# EAGLE design v1 (EAGLE 7.7.0)
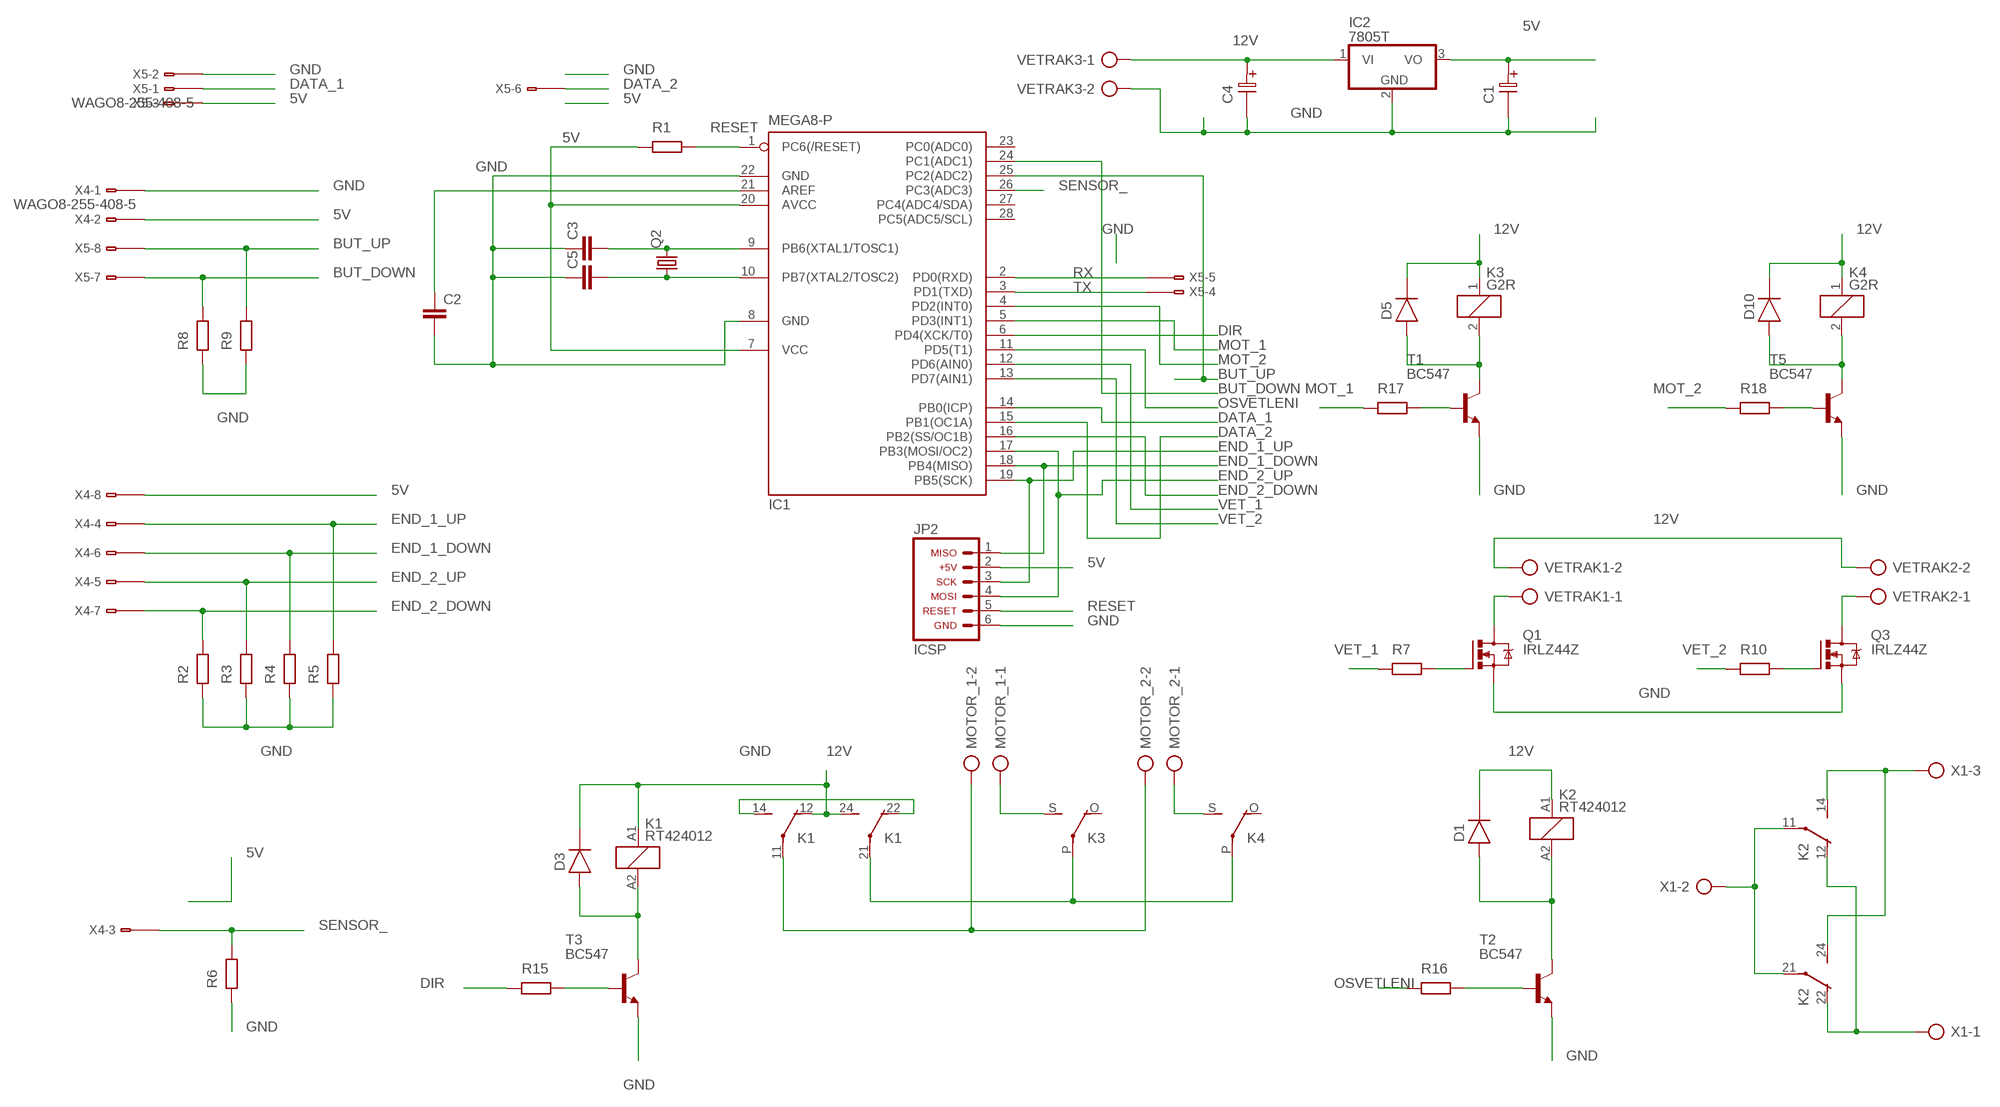
[diagram p0: schematic, sheet 1]

## Parts
C1  CT12  [CT12]
C2  C-EU025-030X050  [C025-030X050]
C3  C-EU050-025X075  [C050-025X075]
C4  CT12  [CT12]
C5  C-EU050-025X075  [C050-025X075]
D1  1N4007  [DO41]
D3  1N4007  [DO41]
D5  1N4007  [DO41]
D10  1N4007  [DO41]
IC1  MEGA8-P  [DIL28-3]
IC2  7805T  [TO220H]
JP2  ARDUINO_CONN-ICSP  [CONN-2X03]
K1  RT424012  [RT2C/O]
K2  RT424012  [RT2C/O]
K3  G2R  [G2R]
K4  G2R  [G2R]
MOTOR_1  AK500/2  [AK500/2]
MOTOR_2  AK500/2  [AK500/2]
Q1  IRLZ44Z  [TO220BH]
Q2  CRYSTALHC49S  [HC49/S]
Q3  IRLZ44Z  [TO220BH]
R1  RR  [RR]
R2  RR  [RR]
R3  RR  [RR]
R4  RR  [RR]
R5  RR  [RR]
R6  RR  [RR]
R7  RR  [RR]
R8  RR  [RR]
R9  RR  [RR]
R10  RR  [RR]
R15  RR  [RR]
R16  RR  [RR]
R17  RR  [RR]
R18  RR  [RR]
T1  BC547  [TO92]
T2  BC547  [TO92]
T3  BC547  [TO92]
T5  BC547  [TO92]
VETRAK1  AK500/2  [AK500/2]
VETRAK2  AK500/2  [AK500/2]
VETRAK3  AK500/2  [AK500/2]
X1  AK500/3-H  [AK500/3-H]
X4  WAGO8-255-408-5  [255-408-5]
X5  WAGO8-255-408-5  [255-408-5]

## Nets
5V: C1.1 IC1.7(VCC) IC1.20(AVCC) IC2.3(VO) JP2.2 R1.1 X4.B2(-2:B1) X4.B8(-8:B1) X5.B3(-3:B1)
12V: C4.1 D1.K D3.K D5.K D10.K IC2.1(VI) K1.12(2:O) K1.24(3:S) K1.A1 K2.A1 K3.1 K4.1 VETRAK1.2 VETRAK2.2 VETRAK3.1
BUT_DOWN: IC1.24(PC1(ADC1)) R8.2 X5.B7(-7:B1)
BUT_UP: IC1.25(PC2(ADC2)) R9.2 X5.B8(-8:B1)
DATA_1: IC1.14(PB0(ICP)) X5.B1(-1:B1)
DATA_2: IC1.15(PB1(OC1A)) X5.B6(-6:B1)
DIR: IC1.6(PD4(XCK/T0)) R15.1
END_1_DOWN: IC1.18(PB4(MISO)) JP2.1 R4.2 X4.B6(-6:B1)
END_1_UP: IC1.19(PB5(SCK)) JP2.3 R5.2 X4.B4(-4:B1)
END_2_DOWN: IC1.16(PB2(SS/OC1B)) R2.2 X4.B7(-7:B1)
END_2_UP: IC1.17(PB3(MOSI/OC2)) JP2.4 R3.2 X4.B5(-5:B1)
GND: C1.2 C2.2 C3.1 C4.2 C5.1 IC1.8(GND) IC1.22(GND) IC2.2(GND) JP2.6 K1.14(2:S) K1.22(3:O) Q1.S Q3.S R2.1 R3.1 R4.1 R5.1 R6.1 R8.1 R9.1 T1.1(E) T2.1(E) T3.1(E) T5.1(E) VETRAK3.2 X4.B1(-1:B1) X5.B2(-2:B1)
MOT_1: IC1.5(PD3(INT1)) R17.1
MOT_2: IC1.4(PD2(INT0)) R18.1
N$1: D3.A K1.A2 T3.3(C)
N$2: Q3.G R10.2
N$3: K1.11(2:P) MOTOR_1.2 MOTOR_2.2
N$4: K1.21(3:P) K3.P(2:P) K4.P(2:P)
N$5: K4.S(2:S) MOTOR_2.1
N$6: K3.S(2:S) MOTOR_1.1
N$7: R18.2 T5.2(B)
N$8: R15.2 T3.2(B)
N$9: C3.2 IC1.9(PB6(XTAL1/TOSC1)) Q2.2
N$10: C5.2 IC1.10(PB7(XTAL2/TOSC2)) Q2.1
N$11: D10.A K4.2 T5.3(C)
N$12: D5.A K3.2 T1.3(C)
N$13: R17.2 T1.2(B)
N$14: K2.12(2:O) K2.22(3:O) X1.1
N$15: D1.A K2.A2 T2.3(C)
N$16: K2.14(2:S) K2.24(3:S) X1.3
N$17: Q1.G R7.2
N$18: C2.1 IC1.21(AREF)
N$21: R16.2 T2.2(B)
N$23: Q3.D VETRAK2.1
N$24: Q1.D VETRAK1.1
N$26: K2.11(2:P) K2.21(3:P) X1.2
OSVETLENI: IC1.11(PD5(T1)) R16.1
RESET: IC1.1(PC6(/RESET)) JP2.5 R1.2
RX: IC1.2(PD0(RXD)) X5.B5(-5:B1)
SENSOR_: IC1.26(PC3(ADC3)) R6.2 X4.B3(-3:B1)
TX: IC1.3(PD1(TXD)) X5.B4(-4:B1)
VET_1: IC1.12(PD6(AIN0)) R7.1
VET_2: IC1.13(PD7(AIN1)) R10.1
Unconnected: IC1.23(PC0(ADC0)) IC1.27(PC4(ADC4/SDA)) IC1.28(PC5(ADC5/SCL)) K3.O(2:O) K4.O(2:O) X4.A1(-1:A1) X4.A2(-2:A1) X4.A3(-3:A1) X4.A4(-4:A1) X4.A5(-5:A1) X4.A6(-6:A1) X4.A7(-7:A1) X4.A8(-8:A1) X5.A1(-1:A1) X5.A2(-2:A1) X5.A3(-3:A1) X5.A4(-4:A1) X5.A5(-5:A1) X5.A6(-6:A1) X5.A7(-7:A1) X5.A8(-8:A1)

## Library data of the parts
C1 C4 = #_GM99:CT12
C2 C3 C5 = rcl:C-EU: CAPACITOR, European symbol
D1 D3 D5 D10 = #_GM99:1N4007
IC1 = atmel:MEGA8-P: MICROCONTROLLER 8 Kbytes FLASH, 1 kbytes SRAM, 512 bytes EEPROM, USART, 4-channel 10 bit ADC, 2-channel 8 bit ADC Pin compatible with Atmega48, ATMega88, ATMega168 Source: avr.lbr; OC_FARNELL: unknown; OC_NEWARK: unknown
IC2 = linear:78*: Positive VOLTAGE REGULATOR Source: http://cache.national.com/ds/LM/LM78L05.pdf http://www.fairchildsemi.com/ds/LM/LM7805.pdf
JP2 = arduino_jw:ARDUINO_CONN-ICSP: Arduino ICSP I/O Header This is the ICSP I/O header on the Arduino Uno R3. This connector is labeled with the following pin assignments: MISO +5V SCK MOSI RESET GND NOTE: Be sure you install this connector with the correct orientation on your PCB layout. Pin 1 has a square pad to assist with orientation.
K1 K2 = relay:RT42?*: Power PCB Relay SCHRACK 2 pole 8 A, DC and AC-coil Source: http://www.schrack.com/.. 5842.pdf; MPN: RT424012; OC_FARNELL: 1629053; OC_NEWARK: 03P2426
K3 K4 = relay:G2R: RELAY 1 x switch, Omron; OC_FARNELL: 1569185; OC_NEWARK: unknown
MOTOR_1 MOTOR_2 VETRAK1-VETRAK3 = #Svorkovnice:AK500/2: CONNECTOR
Q1 Q3 = transistor-power:IRLZ44Z: N-Channel HEXFET® Power MOSFET Logic Level AUTOMOTIVE MOSFET Source: http://www.irf.com/product-info/datasheets/data/irlz44zpbf.pdf
Q2 = crystal:CRYSTAL: CRYSTAL; OC_FARNELL: 1667008; OC_NEWARK: unknown
R1-R10 R15-R18 = #_GM99:RR
T1-T3 T5 = transistor-neu-to92:BC547: NPN TRANSISTOR
X1 = con-ptr500:AK500/3-H: CONNECTOR Aug. 2004 / PTR Meßtechnik: Die Bezeichnung der Serie AK505 wurde geändert. Es handelt sich hierbei um AK500 in horizontaler Ausführung.; OC_FARNELL: unknown; OC_NEWARK: unknown
X4 X5 = con-wago:WAGO8-: WAGO Cage Clamp; MPN: 255-408; OC_FARNELL: unknown; OC_NEWARK: 28K9773

## Board
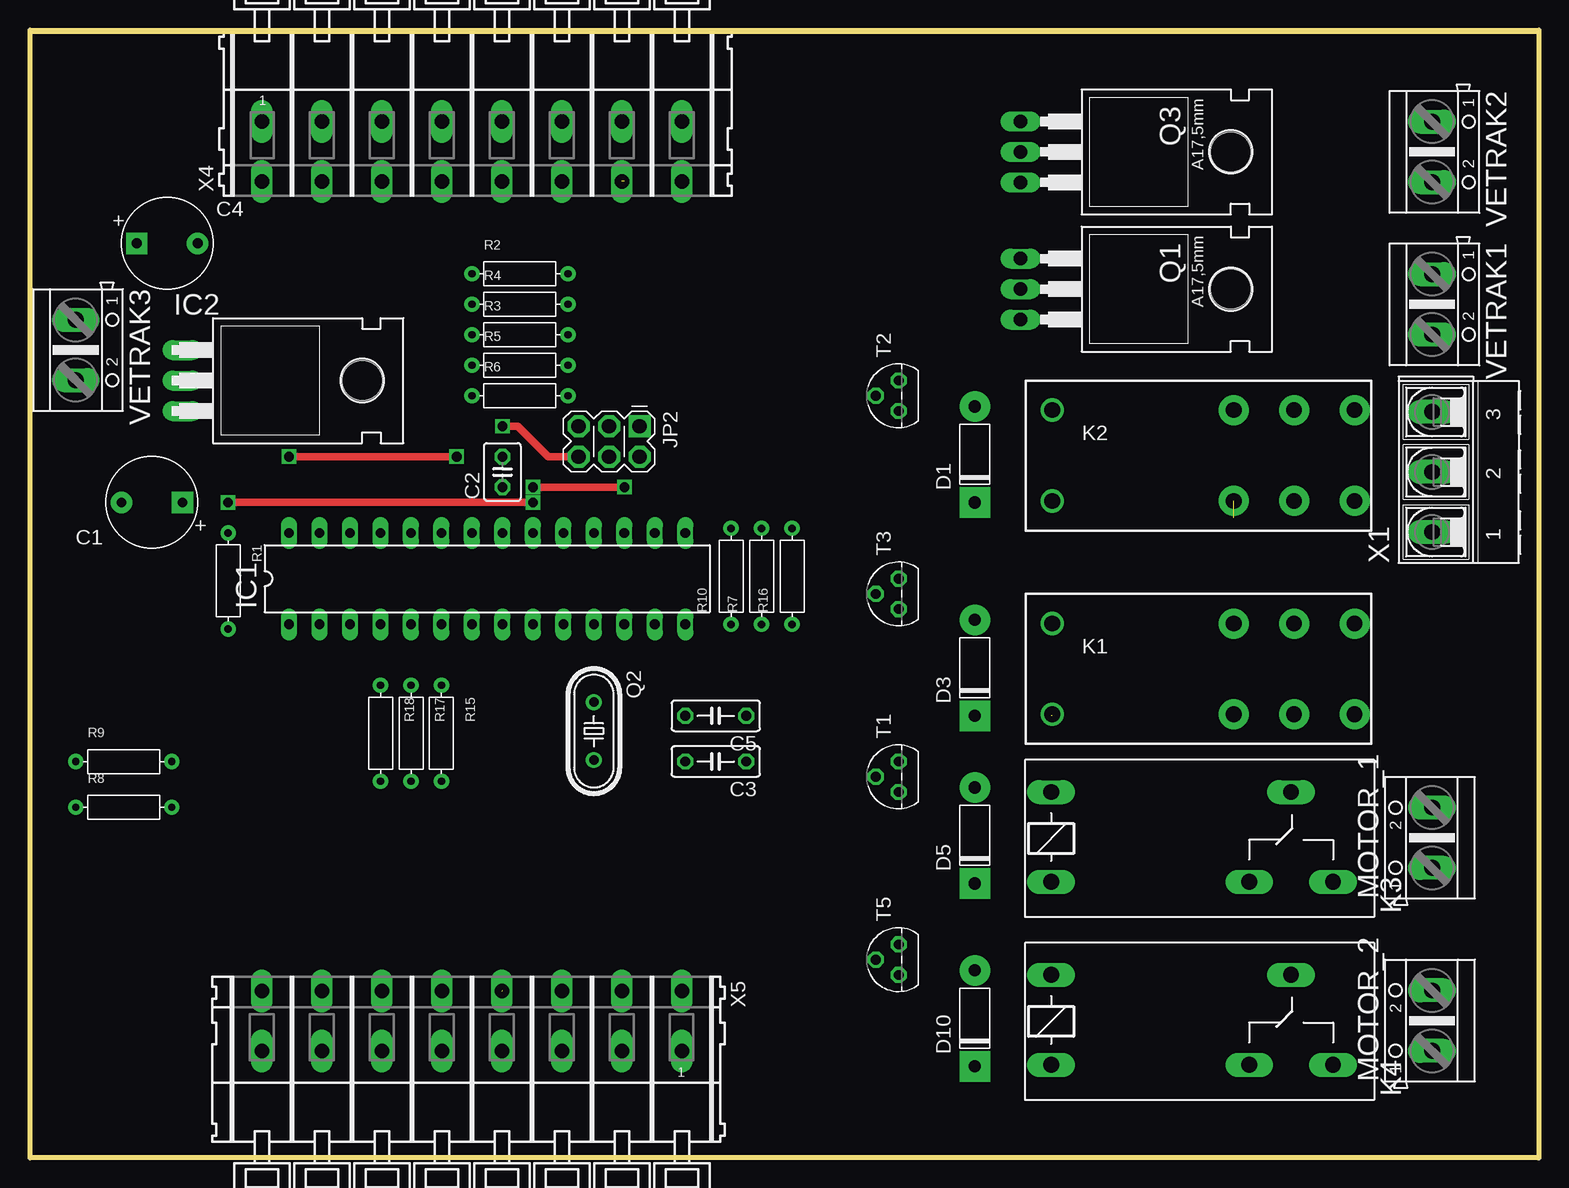
[diagram p1: board, top side]
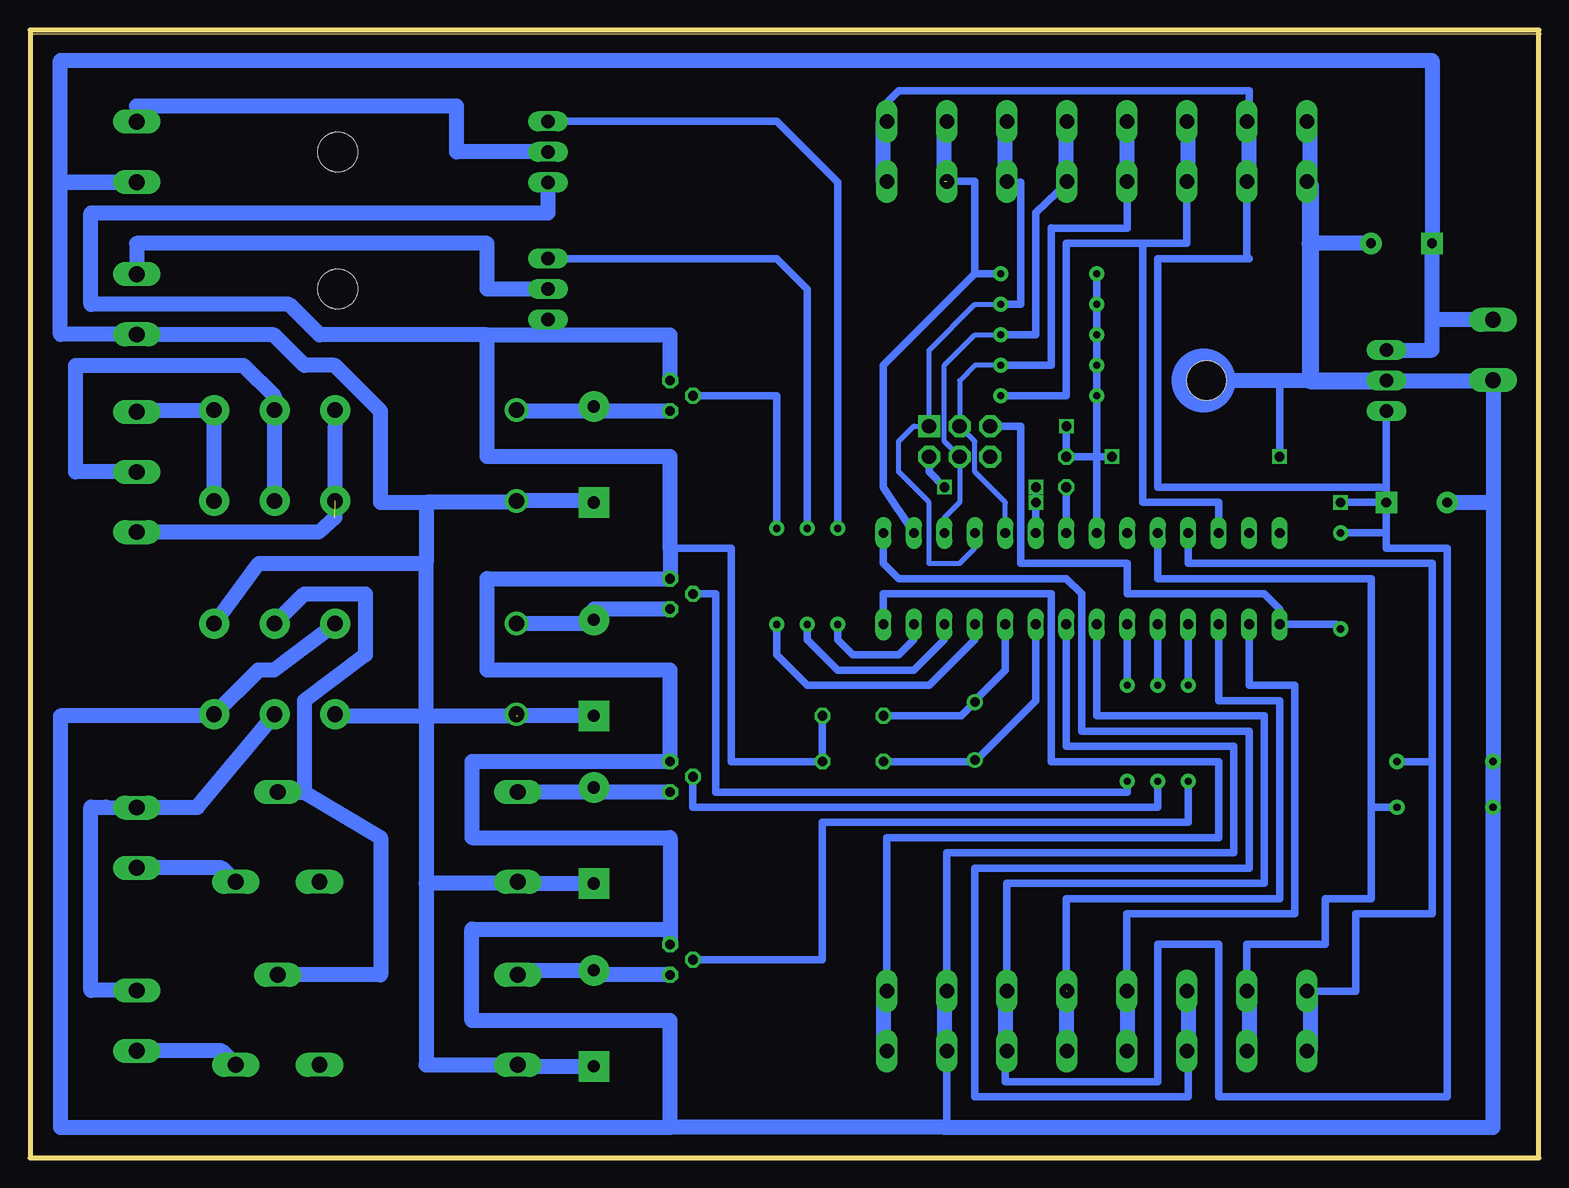
[diagram p2: board, bottom side, seen from below]

Size 125.73 x 93.98 mm. Coordinates in mm from the lower left corner, seen from the top.
Outline: 125.71,0 125.71,93.65 0,93.65
Outline: 0,93.65 0,0 125.71,0
Outline: 0,93.65 0,93.98 125.73,93.98 125.73,0 125.71,0
Copper layers (1*16): Top 0.035mm / dielectric 1.5mm / Bottom 0.035mm
Design rules "default": minimum track width 10mil, minimum drill 24mil, track to track 8mil, track to pad 8mil, pad to pad 8mil, via to via 8mil, smd to smd 8mil, copper to edge 40mil, drill to drill 8mil, minimum pad ring 10mil, minimum via ring 8mil, stop-mask expansion 4mil, vias tented up to drill 0mil, thermal gap 10mil

### Footprints (pad centres in the part's own frame; a part is rotated, then mirrored left to right if it is on the bottom)
CT12 = drill 0.813 pad 1.778 square: 1 0,0 | drill 0.813 pad 1.778: 2 5.08,0
C025-030X050 = drill 0.813 octagon: 1 -1.27,0; 2 1.27,0
C050-025X075 = drill 0.813 octagon: 1 -2.54,0; 2 2.54,0
DO41 = drill 1.016 pad 2.54: A 8,0 | drill 1.016 pad 2.54 square: K 0,0
DIL28-3 = drill 0.813 long: 1 -16.51,-3.81; 2 -13.97,-3.81; 3 -11.43,-3.81; 4 -8.89,-3.81; 5 -6.35,-3.81; 6 -3.81,-3.81; 7 -1.27,-3.81; 8 1.27,-3.81; 9 3.81,-3.81; 10 6.35,-3.81; 11 8.89,-3.81; 12 11.43,-3.81; 13 13.97,-3.81; 14 16.51,-3.81; 15 16.51,3.81; 16 13.97,3.81; 17 11.43,3.81; 18 8.89,3.81; 19 6.35,3.81; 20 3.81,3.81; 21 1.27,3.81; 22 -1.27,3.81; 23 -3.81,3.81; 24 -6.35,3.81; 25 -8.89,3.81; 26 -11.43,3.81; 27 -13.97,3.81; 28 -16.51,3.81
TO220H = drill 1.118 long: 1 -2.54,-10.16; 2 0,-10.16; 3 2.54,-10.16 | hole 3.302: 0,4.826
CONN-2X03 = drill 1.2 pad 1.829 square: 1 0,0 | drill 1.2 pad 1.829 octagon: 2 2.54,0; 3 0,-2.54; 4 2.54,-2.54; 5 0,-5.08; 6 2.54,-5.08
RT2C/O = drill 1.3 pad 2.5: 11 7.56,-3.68; 12 2.52,-3.68; 14 12.6,-3.68; 21 7.56,3.88; 22 2.52,3.88; 24 12.6,3.88 | drill 1.3: A1 -12.6,-3.68; A2 -12.6,3.88
G2R = drill 1.321 long: 1 -2.54,-3.683; 2 -2.54,3.81; O 13.97,-3.683; P 17.45,3.81; S 20.955,-3.683
AK500/2 = drill 1.321 long: 1 -2.515,0; 2 2.515,0
TO220BH = drill 1.118 long: D 0,-6.35; G -2.54,-6.35; S 2.54,-6.35 | hole 3.302: 0,11.176
HC49/S = drill 0.813: 1 -2.413,0; 2 2.413,0
RR = drill 0.61 pad 1.27: 1 0,0; 2 8,0
TO92 = drill 0.813 octagon: 1 1.27,0; 2 0,1.905; 3 -1.27,0
AK500/3-H = drill 1.321 long: 1 -5.004,0; 2 0,0; 3 5.004,0
255-408-5 = drill 1.2 long: A1 -17.5,0; A2 -12.5,0; A3 -7.5,0; A4 -2.5,0; A5 2.5,0; A6 7.5,0; A7 12.5,0; A8 17.5,0; B1 -17.5,-5; B2 -12.5,-5; B3 -7.5,-5; B4 -2.5,-5; B5 2.5,-5; B6 7.5,-5; B7 12.5,-5; B8 17.5,-5

### Placement (x,y rotation side)
C1  12.7,54.61 180 top
C2  39.37,57.15 90 top
C3  57.15,33.02 180 top
C4  8.89,76.2 0 top
C5  57.15,36.83 180 top
D1  78.74,54.61 90 top
D3  78.74,36.83 90 top
D5  78.74,22.86 90 top
D10  78.74,7.62 90 top
IC1  38.1,48.26 0 top
IC2  22.86,64.77 270 top
JP2  50.8,60.96 270 top
K1  97.79,40.64 0 top
K2  97.79,58.42 0 top
K3  87.63,26.67 0 top
K4  87.63,11.43 0 top
MOTOR_1  116.84,26.67 90 top
MOTOR_2  116.84,11.43 90 top
Q1  88.9,72.39 270 top
Q2  46.99,35.56 270 top
Q3  88.9,83.82 270 top
R1  16.51,52.07 270 top
R2  36.83,73.66 0 top
R3  36.83,68.58 0 top
R4  36.83,71.12 0 top
R5  36.83,66.04 0 top
R6  36.83,63.5 0 top
R7  60.96,44.45 90 top
R8  3.81,29.21 0 top
R9  3.81,33.02 0 top
R10  58.42,44.45 90 top
R15  34.29,39.37 270 top
R16  63.5,44.45 90 top
R17  31.75,39.37 270 top
R18  29.21,39.37 270 top
T1  72.39,31.75 90 top
T2  72.39,63.5 90 top
T3  72.39,46.99 90 top
T5  72.39,16.51 90 top
VETRAK1  116.84,71.12 270 top
VETRAK2  116.84,83.82 270 top
VETRAK3  3.81,67.31 270 top
X1  116.84,57.15 90 top
X4  36.83,86.36 0 top
X5  36.83,8.89 180 top

### Tracks (layer width: path | path; a pad name or v marks a point on that pad's centre or on a via)
5V  (via drill 0.8 pad 1.02)
  Top 0.61: v49.53,55.88 v41.91,55.88 | v41.91,54.61 v16.51,54.61
  Bottom 0.61: IC1.7 36.83,36.83 22.86,36.83 22.86,22.86 44.33,22.86 X5.B3 44.45,13.89 | 12.7,55.88 C1.1 | C1.1 12.7,52.07 R1.1 | 24.13,81.36 X4.B2 | X4.B8 54.33,87.91 53.34,88.9 24.13,88.9 24.13,86.36 24.13,81.56 X4.B2 | 12.7,55.88 31.75,55.88 31.75,74.93 24.13,74.93 24.33,75.13 X4.B2 | 12.7,55.88 IC2.3 | C1.1 12.7,50.8 7.62,50.8 7.62,5.08 26.67,5.08 26.67,17.78 31.75,17.78 31.75,6.35 44.45,6.35 44.45,8.89 44.45,13.89 | 44.45,13.97 44.45,13.89 | JP2.2 50.8,57.15 v49.53,55.88 | v41.91,55.88 v41.91,54.61 IC1.20 | v16.51,54.61 C1.1
  Bottom 1.27: 24.13,81.28 24.13,86.36 | 44.45,13.97 44.45,8.89
12V  (1 unrouted)
  Bottom 0.61: VETRAK1.2 116.86,68.58
  Bottom 1.27: D10.K 84.96,7.62 K4.1 92.71,7.75 92.71,22.86 | D5.K 84.96,22.86 K3.1 85.09,22.86 92.71,22.86 | D3.K 85.09,36.83 | 92.71,36.83 92.71,49.53 | 92.71,54.61 96.52,54.61 96.52,62.23 100.33,66.04 102.87,66.04 105.41,68.58 116.81,68.58 VETRAK1.2 123.19,68.61 123.19,81.28 | 92.71,54.61 92.71,49.53 | D1.K 78.87,54.74 K2.A1 85.32,54.61 92.71,54.61 | K1.24 106.65,49.53 92.71,49.53 | K1.12 100.18,36.83 92.71,36.83 | 123.19,81.28 116.84,81.28 VETRAK2.2 123.19,81.31 | 123.19,81.31 123.19,81.28 | 123.19,81.31 123.19,91.44 8.89,91.44 C4.1 8.89,69.83 | IC2.1 8.89,67.31 8.89,69.83 | VETRAK3.1 8.89,69.83 | 92.71,36.83 85.19,36.83 K1.A1 | 92.71,36.83 92.71,22.86
BUT_DOWN
  Bottom 0.61: X5.B7 24.33,17.78 17.78,17.78 17.78,21.59 13.97,21.59 13.97,29.21 | 13.97,29.21 13.97,48.26 31.75,48.26 IC1.24 | R8.2 13.97,29.21
BUT_UP
  Bottom 0.61: X5.B8 15.24,13.89 15.24,20.32 8.89,20.32 8.89,33.02 | 8.89,33.02 8.89,49.53 29.21,49.53 IC1.25 | R9.2 8.89,33.02
DATA_1
  Bottom 0.61: IC1.14 54.61,46.99 40.64,46.99 40.64,33.02 26.67,33.02 26.67,26.67 54.33,26.67 X5.B1
DATA_2
  Bottom 0.61: IC1.15 54.61,49.53 53.34,48.26 39.37,48.26 38.1,46.99 38.1,35.56 24.13,35.56 24.13,24.13 46.99,24.13 46.99,5.08 29.21,5.08 29.21,8.89 29.21,13.77 X5.B6
  Bottom 1.27: 29.21,13.97 29.21,8.89
DIR
  Bottom 0.61: IC1.6 R15.1
END_1_DOWN
  Bottom 0.406: R4.2 46.99,71.12 50.8,67.31 JP2.1 52.07,60.96 53.34,59.69 53.34,57.15 50.8,54.61 50.8,49.53 48.26,49.53 46.99,50.8 IC1.18
  Bottom 0.61: R4.2 43.18,71.12 43.18,81.28 44.25,81.28 | 44.45,81.28 44.25,81.28 | 44.25,81.28 X4.B6
  Bottom 1.27: 44.45,81.28 44.45,86.36
END_1_UP
  Bottom 0.406: R5.2 46.99,66.04 48.26,64.77 JP2.3 46.99,59.69 46.99,57.15 44.45,54.61 IC1.19
  Bottom 0.61: R5.2 40.64,66.04 40.64,77.47 | 40.64,77.51 40.64,77.47 | 40.64,77.47 34.29,77.47 34.29,81.28 34.29,81.36 X4.B4
  Bottom 1.27: 34.29,81.28 34.29,86.36
END_2_DOWN  (1 unrouted)
  Bottom 0.61: R2.2 46.99,73.66 | 46.99,73.66 54.61,66.04 54.61,55.88 IC1.16 | 49.53,81.36 46.99,81.36 46.99,73.66
END_2_UP
  Bottom 0.406: R3.2 46.99,68.58 49.53,66.04 49.53,59.69 JP2.4 48.26,54.61 49.53,53.34 IC1.17
  Bottom 0.61: R3.2 41.91,68.58 41.91,78.74 39.25,81.28 X4.B5
GND  (via drill 0.8 pad 1.02)
  Top 0.61: v35.56,58.42 v21.59,58.42 | JP2.6 43.18,58.42 40.64,60.96 v39.37,60.96
  Bottom 0.61: IC1.8 39.37,34.29 25.4,34.29 25.4,25.4 49.33,25.4 X5.B2 49.33,2.54 49.53,2.54 | 3.81,18.97 R8.1 R9.1 | 36.83,58.42 C2.2 v39.37,60.96 | 36.83,58.42 IC1.22 | R2.1 R4.1 R3.1 R5.1 R6.1 36.83,58.42 | 36.83,58.42 v35.56,58.42 | v21.59,58.42 21.59,64.77 19.05,64.77 | 72.39,50.8 67.31,50.8 67.31,33.02 C3.1 C5.1
  Bottom 1.27: K1.14 106.71,40.64 106.68,40.64 | 105.41,40.64 100.31,44.47 K1.22 105.41,40.64 | 105.41,40.64 106.68,40.64 | 106.68,40.64 110.49,36.83 123.19,36.83 123.19,2.54 72.39,2.54 | Q3.S 82.55,78.74 120.65,78.74 120.65,71.12 104.14,71.12 101.6,68.58 87.63,68.58 | C4.2 19.05,76.2 | 3.81,64.77 3.81,54.61 | 3.81,54.61 R9.1 3.81,2.54 49.53,2.54 72.39,2.54 | IC2.2 3.81,64.77 | 3.81,64.77 VETRAK3.2 | C1.2 3.81,54.61 | T2.1 72.39,68.58 82.55,68.58 | 87.63,68.58 87.63,58.42 72.39,58.42 72.39,50.8 T3.1 87.63,48.26 87.63,40.64 72.39,40.64 T1.1 88.9,33.02 88.9,26.67 72.39,26.67 72.39,19.05 | 72.39,19.05 T5.1 | 72.39,2.54 72.39,11.43 88.9,11.43 88.9,19.05 72.39,19.05 | 87.63,68.58 82.55,68.58 | Q1.S 82.55,68.58 | 19.05,64.77 26.67,64.77
  Bottom 1.422: X4.B1 19.05,81.08 19.05,76.2 19.05,64.77 IC2.2
MOT_1
  Bottom 0.61: IC1.5 R17.1
MOT_2
  Bottom 0.61: IC1.4 R18.1
N$1
  Bottom 1.27: K1.A2 79.05,44.52 D3.A 78.74,45.72 T3.3
N$2
  Bottom 0.61: Q3.G 63.5,86.36 58.42,81.28 R10.2
N$3
  Bottom 1.27: K1.11 111.76,29.28 111.76,29.21 111.78,29.19 MOTOR_1.2 119.38,29.21 120.65,29.21 120.65,13.94 MOTOR_2.2
N$4
  Bottom 1.27: K1.21 105.28,44.45 105.41,44.45 102.87,46.99 97.79,46.99 97.79,41.91 102.87,38.1 102.87,30.48 | 102.87,30.48 96.52,26.67 96.52,15.24 K4.P | 105.41,30.48 K3.P 102.87,30.48
N$5
  Bottom 1.27: K4.S 109.75,8.91 MOTOR_2.1
N$6
  Bottom 1.27: K3.S 109.75,24.16 MOTOR_1.1
N$7
  Bottom 0.61: R18.2 29.21,27.94 59.69,27.94 59.69,16.51 T5.2
N$8
  Bottom 0.61: R15.2 34.29,30.48 68.58,30.48 68.58,46.99 T3.2
N$9
  Bottom 0.61: IC1.9 41.91,38.1 46.99,33.02 | 46.99,33.02 C3.2 | 46.99,33.02 Q2.2
N$10
  Bottom 0.61: IC1.10 44.45,40.64 46.99,38.1 Q2.1 48.13,36.83 C5.2
N$11
  Bottom 1.27: K4.2 84.71,15.62 D10.A 78.74,15.24 T5.3
N$12
  Bottom 1.27: K3.2 79.12,30.48 D5.A 78.74,30.48 T1.3
N$13
  Bottom 0.61: R17.2 31.75,29.21 70.48,29.21 T1.2
N$14  (1 unrouted)
  Bottom 1.27: K2.22 100.33,59.74 100.33,53.34 101.68,52.15 X1.1
N$15
  Bottom 1.27: K2.A2 85.16,62.3 85.09,62.23 79.12,62.23 D1.A 78.74,62.23 T2.3
N$16
  Bottom 1.27: K2.14 K2.24 116.69,62.3 X1.3
N$17
  Bottom 0.61: Q1.G 63.5,74.93 60.96,72.39 R7.2
N$18
  Bottom 0.61: IC1.21 C2.1
N$21
  Bottom 0.61: T2.2 63.5,63.5 63.5,58.42 63.5,54.61 R16.2
N$23
  Bottom 1.27: Q3.D 90.17,83.82 90.17,87.63 116.84,87.63 VETRAK2.1
N$24
  Bottom 1.27: Q1.D 87.63,72.39 87.63,76.2 116.84,76.2 VETRAK1.1
N$26
  Bottom 1.27: K2.11 K2.21 105.35,63.44 107.95,66.04 121.92,66.04 121.92,57.15 X1.2
N$27
  Bottom 1.27: 19.05,81.28 19.05,86.36
N$28
  Bottom 1.27: 29.21,81.28 29.21,86.36
N$29
  Bottom 1.27: 39.37,81.28 39.37,86.36
N$30
  Bottom 1.27: 49.53,81.28 49.53,86.36
N$31
  Bottom 1.27: 54.61,81.28 54.61,86.36
N$32
  Bottom 1.27: 19.05,13.97 19.05,8.89
N$33
  Bottom 1.27: 24.13,13.97 24.13,8.89
N$34
  Bottom 1.27: 34.29,13.97 34.29,8.89
N$35
  Bottom 1.27: 49.53,13.97 49.53,8.89
N$36
  Bottom 1.27: 54.61,13.97 54.61,8.89
OSVETLENI
  Bottom 0.61: IC1.11 46.99,43.18 50.8,39.37 60.96,39.37 63.5,41.91 R16.1
RESET
  Bottom 0.61: JP2.5 43.18,60.96 43.18,49.53 34.29,49.53 34.29,46.99 22.86,46.99 21.59,45.72 IC1.1 16.89,44.45 R1.2
RX
  Bottom 0.61: IC1.2 24.13,39.37 20.32,39.37 20.32,20.32 34.33,20.32 X5.B5
SENSOR_
  Bottom 0.61: X4.B3 29.33,76.2 33.02,76.2 | 33.02,76.2 39.37,76.2 39.37,63.5 R6.2 | IC1.26 26.67,54.61 33.02,54.61 33.02,76.2
TX  (1 unrouted)
  Bottom 0.61: IC1.3 26.67,38.1 21.59,38.1 21.59,21.59 39.37,21.59 39.37,13.97
  Bottom 1.27: 39.37,13.97 39.37,8.89
VET_1
  Bottom 0.61: IC1.12 49.53,43.18 52.07,40.64 58.42,40.64 60.96,43.18 R7.1
VET_2
  Bottom 0.61: IC1.13 52.07,43.18 53.34,41.91 57.15,41.91 58.42,43.18 R10.1
(copper drawn outside any net)
  shapes: Bottom circle x1